# Altium project Low_Power_Electronic_Load.PrjPcb
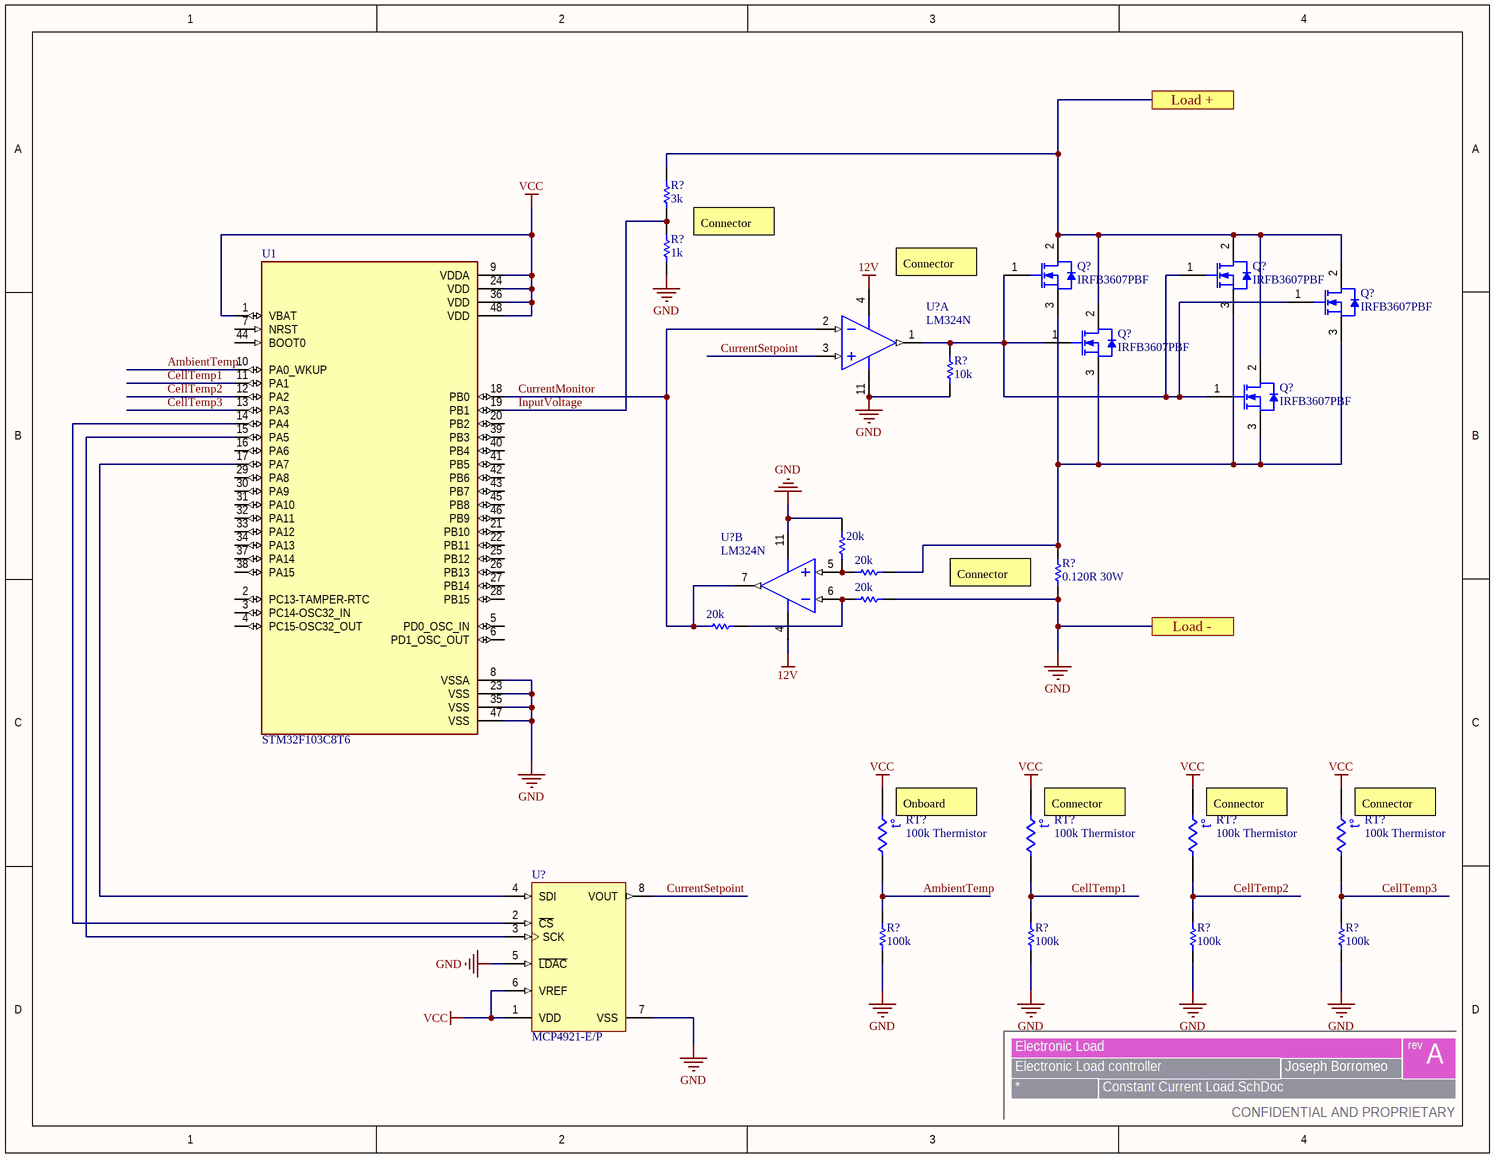
[diagram p0: Constant Current Load.SchDoc]
ProjectTitle: Electronic Load
1 sheet, 25 parts. Net scope: flat (ports and power ports of the same name join across sheets).

## Sheet Constant Current Load.SchDoc: Electronic Load controller
size Letter; Author: Joseph Borromeo; Revision: A

### Parts
(Parts that share a designator on the sheet are numbered #1, #2 ... from top to bottom, then left to right.)
20k#1  (no value)  [AXIAL-0.3]
20k#2  (no value)  [AXIAL-0.3]
20k#3  (no value)  [AXIAL-0.3]
20k#4  (no value)  [AXIAL-0.3]
Q?#1  IRFB3607PBF  [INF-PG-TO-263-3-2_A_M]
Q?#2  IRFB3607PBF  [INF-PG-TO-263-3-2_A_M]
Q?#3  IRFB3607PBF  [INF-PG-TO-263-3-2_A_M]
Q?#4  IRFB3607PBF  [INF-PG-TO-263-3-2_A_M]
Q?#5  IRFB3607PBF  [INF-PG-TO-263-3-2_A_M]
R?#1  3k  [AXIAL-0.3]
R?#2  1k  [AXIAL-0.3]
R?#3  10k  [AXIAL-0.3]
R?#4  0.120R 30W  [AXIAL-0.3]
R?#5  100k  [AXIAL-0.3]
R?#6  100k  [AXIAL-0.3]
R?#7  100k  [AXIAL-0.3]
R?#8  100k  [AXIAL-0.3]
RT?#1  100k Thermistor  [6-0805_N]
RT?#2  100k Thermistor  [6-0805_N]
RT?#3  100k Thermistor  [6-0805_N]
RT?#4  100k Thermistor  [6-0805_N]
U1  STM32F103C8T6  [QFP50P900X900X160-48N]
U?#1  LM324N  [N0014A]  (part A of 4)
U?#2  LM324N  [N0014A]  (part B of 4)
U?#3  MCP4921-E/P  [PDIP300-P8]

### Ports
Load +, Load -

### Nets
12V: U?#1.4(V+) U?#2.4(V+)
GND: 20k#1.1 20k#3.1 R?#2.1 R?#3.1 R?#4.1 R?#5.1 R?#6.1 R?#7.1 R?#8.1 U1.8(VSSA) U1.23(VSS) U1.35(VSS) U1.47(VSS) U?#1.11(GND) U?#2.11(GND) U?#3.5(~{LDAC}) U?#3.7(VSS) ; port Load -
VCC: RT?#1.1 RT?#2.1 RT?#3.1 RT?#4.1 U1.1(VBAT) U1.9(VDDA) U1.24(VDD) U1.36(VDD) U1.48(VDD) U?#3.1(VDD) U?#3.6(VREF)
AmbientTemp: R?#5.2 RT?#1.2 U1.10(PA0_WKUP)
CellTemp1: R?#6.2 RT?#2.2 U1.11(PA1)
CellTemp2: R?#7.2 RT?#3.2 U1.12(PA2)
CellTemp3: R?#8.2 RT?#4.2 U1.13(PA3)
CurrentMonitor: 20k#4.2 U1.18(PB0) U?#1.2(IN1-) U?#2.7(OUT2)
CurrentSetpoint: U?#1.3(IN1+) U?#3.8(VOUT)
InputVoltage: R?#1.1 R?#2.2 U1.19(PB1)
Net20k#1_2: 20k#1.2 20k#2.2 U?#2.5(IN2+)
Net20k#2_1: 20k#2.1 Q?#1.3(SOURCE) Q?#2.3(SOURCE) Q?#3.3(SOURCE) Q?#4.3(SOURCE) Q?#5.3(SOURCE) R?#4.2
Net20k#3_2: 20k#3.2 20k#4.1 U?#2.6(IN2-)
NetQ?#1_1: Q?#1.1(GATE) Q?#2.1(GATE) Q?#3.1(GATE) Q?#4.1(GATE) Q?#5.1(GATE) R?#3.2 U?#1.1(OUT1)
NetQ?#1_2: Q?#1.2(DRAIN) Q?#2.2(DRAIN) Q?#3.2(DRAIN) Q?#4.2(DRAIN) Q?#5.2(DRAIN) R?#1.2 ; port Load +
NetU1_14: U1.14(PA4) U?#3.2(~{CS})
NetU1_15: U1.15(PA5) U?#3.3(SCK)
NetU1_17: U1.17(PA7) U?#3.4(SDI)

Not connected (* = marked no-connect by the designer): U1 2(PC13-TAMPER-RTC) 3(PC14-OSC32_IN) 4(PC15-OSC32_OUT) 5(PD0_OSC_IN) 6(PD1_OSC_OUT) 7(NRST) 16(PA6) 20(PB2) 21(PB10) 22(PB11) 25(PB12) 26(PB13) 27(PB14) 28(PB15) 29(PA8) 30(PA9) 31(PA10) 32(PA11) 33(PA12) 34(PA13) 37(PA14) 38(PA15) 39(PB3) 40(PB4) 41(PB5) 42(PB6) 43(PB7) 44(BOOT0) 45(PB8) 46(PB9)

### Notes on the sheet
- (near R?#1) Connector
- Connector
- (near R?#4) Connector
- (near RT?#1) Onboard
- (near RT?#2) Connector
- (near RT?#3) Connector
- (near RT?#4) Connector
- rev
- CONFIDENTIAL AND PROPRIETARY
- (in symbol Res Thermal) t°

### Library data of the parts
20k#1-20k#4 R?#1-R?#8 = Res1: Resistor; Published: 8-Jun-2000; LatestRevisionDate: 17-Jul-2002; LatestRevisionNote: Re-released for DXP Platform.; PackageReference: AXIAL-0.3; Publisher: Altium Limited; PackageDescription: Axial Device, Thru-Hole; 2 Leads; 0.3 in Pin Spacing
Q?#1-Q?#5 = CMP-1091-00234-1: N-Channel OptiMOS 3 Power-Transistor, 75 V VDS, 80 A ID, -55 to 175 degC, PG-TO-263-3-2, Reel, Green; Manufacturer: Infineon; PartNumber: IPB049NE7N3 G; RDS (on) (max): 4.9Â mOhm; Green: TRUE; ID (max): 80Â A; QG: 51Â nC; RthJC (max): 1Â K/W; VGS(th) (max): 3.8Â V; Polarity: N; Ptot (max): 150Â W; RthJA (max): 62 K/W; IDpuls (max): 320Â A; VDS (max): 75Â V; VGS(th) (min): 2.3Â V; ComponentLink1Description: Manufacturer URL; Mounting Technology: Surface Mount; Packing: Reel; ComponentLink3URL: http://www.infineon.com/dgdl/IPB026N06N_Rev2.2.pdf?folderId=db3a304313b8b5a60113cee8763b02d7&fileId=db3a3043372d5cc8013754c7b2a74f7c; PackageDescription: 3-Pin Plastic (Green) Transistor Single Outline Package, 10.06 x 8.98 mm Body, 2.54 mm Pitch; ComponentLink3Description: Package Specification; PackageReference: PG-TO-263-3-2; Halogen-free: TRUE; ComponentLink2URL: http://www.infineon.com/dgdl/IPB049NE7N3_Rev2.2.pdf?folderId=db3a304313b8b5a60113cee8763b02d7&fileId=db3a304320d39d590121a517a48e0bb9; Rth: 1Â K/W; ComponentLink2Description: Datasheet; ComponentLink1URL: http://www.infineon.com/; DatasheetVersion: Rev. 2.2; PackageVersion: Rev. 01, 08/2007
RT?#1-RT?#4 = Res Thermal: Thermistor; Published: 24-Mar-1999; LatestRevisionDate: 29-May-2009; LatestRevisionNote: IPC-7351 Footprint Added.; PackageVersion: Mar-2003; PackageReference: 6-0805; Publisher: Altium Limited; PackageDescription: Chip Resistor 0805 Case Size; Code_IPC: RESC2012
U1 = STM32F103C8T6: ARMÂ® CortexÂ®-M3 STM32F1 Microcontroller IC 32-Bit 72MHz 64KB _64K x 8_ FLASH; MF: STMicroelectronics; Price: None; Package: LQFP-48 STMicroelectronics; Value: *; MP: STM32F103C8T6; Availability: Unavailable; SnapEDA_Link: https://www.snapeda.com/parts/STM32F103C8T6/STMicroelectronics/view-part/52195/?ref=snap
U?#1 U?#2 = CMP-0055-00082-3: Low Power Quad Operational Amplifier, 14-pin MDIP; Manufacturer: Texas Instruments; CompType: Amplifiers; PowerWise: N; PackageTopMarking: NSUZXYYTTE#*LM324N; PackageDescription: MDIP, .750 x .250 x.130in, 14 Lead, .100in Pitch; Package Reference: N0014A; RoHS: N; Code_JEDEC: MS-001-AA; ComponentLink1URL: http://www.ti.com/general/docs/lit/getliterature.tsp?genericPartNumber=LM324&fileType=pdf; ComponentLink1Description: Datasheet URL; PinCount: 14
U?#3 = CMP-0188-00217-2: 12-Bit DAC with SPI Interface, 8-Pin PDIP, Extended Temperature; ComponentLink1Description: Manufacturer URL; ComponentLink2URL: http://ww1.microchip.com/downloads/en/DeviceDoc/22248a.pdf; ComponentLink3Description: Package Specification; PackageVersion: revBB, Aug-2009; PackageReference: PDIP300-P8; ComponentLink1URL: http://www.microchip.com/; PackageDescription: 8-Lead Plastic Dual In-Line (P) - 300 mil Body [PDIP]; Code_JEDEC: MS-001; DatasheetVersion: revA, Apr-2010; ComponentLink2Description: Datasheet; ComponentLink3URL: http://www.microchip.com/stellent/groups/techpub_sg/documents/packagingspec/en012702.pdf; RevisionNote: URLs added. DatasheetVersion updated. Sch updated.